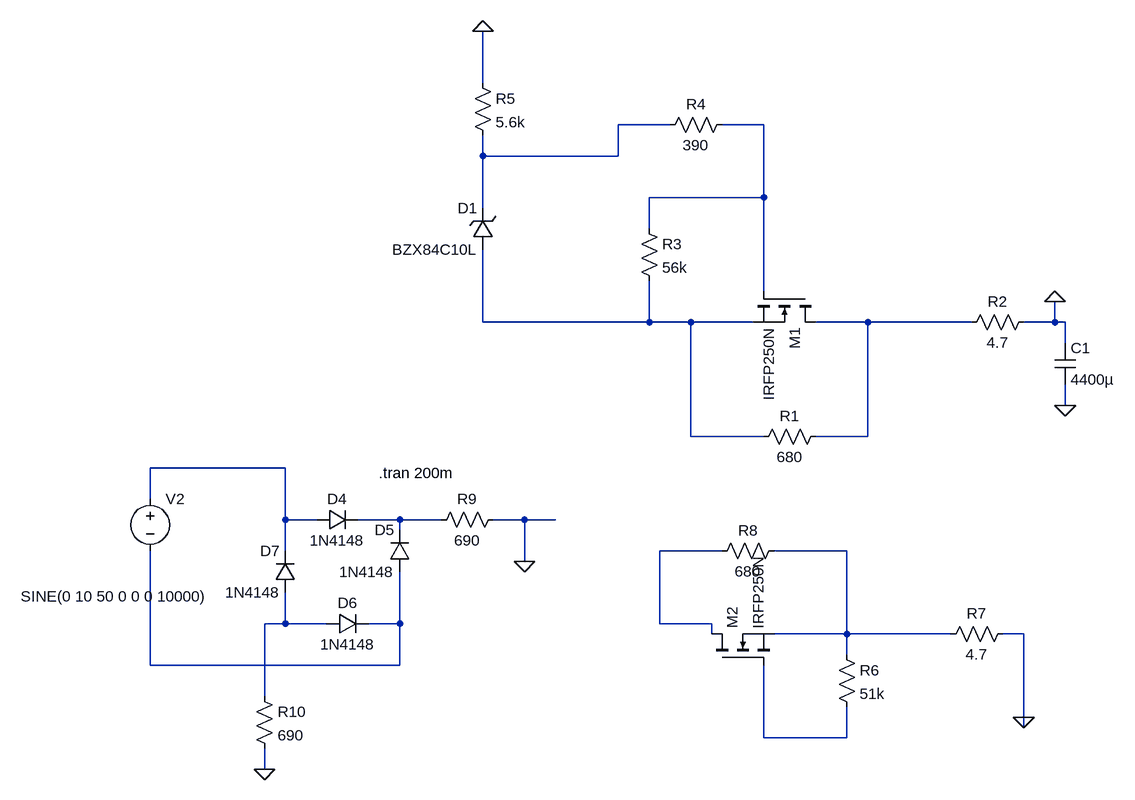
[diagram p0: schematic ikmi.asc]
ikmi.asc, the LTspice schematic file:
Version 4.1
SHEET 1 880 900
WIRE -256 -176 -256 -256
WIRE 32 -112 -48 -112
WIRE 176 -112 112 -112
WIRE -256 -64 -256 -96
WIRE -48 -64 -48 -112
WIRE -48 -64 -256 -64
WIRE 176 0 176 -112
WIRE 176 0 0 0
WIRE -256 16 -256 -64
WIRE 0 48 0 0
WIRE 176 144 176 0
WIRE -256 192 -256 80
WIRE 0 192 0 128
WIRE 0 192 -256 192
WIRE 64 192 0 192
WIRE 160 192 64 192
WIRE 336 192 256 192
WIRE 496 192 336 192
WIRE 624 192 624 160
WIRE 624 192 576 192
WIRE 640 192 624 192
WIRE 640 224 640 192
WIRE 640 320 640 288
WIRE 64 368 64 192
WIRE 176 368 64 368
WIRE 336 368 336 192
WIRE 336 368 256 368
WIRE -560 416 -768 416
WIRE -768 464 -768 416
WIRE -560 496 -560 416
WIRE -512 496 -560 496
WIRE -384 496 -448 496
WIRE -320 496 -384 496
WIRE -192 496 -240 496
WIRE -144 496 -192 496
WIRE -384 512 -384 496
WIRE -560 544 -560 496
WIRE 112 544 16 544
WIRE 304 544 192 544
WIRE -192 560 -192 496
WIRE -560 656 -560 608
WIRE -560 656 -592 656
WIRE -496 656 -560 656
WIRE -384 656 -384 576
WIRE -384 656 -432 656
WIRE 16 656 16 544
WIRE 96 656 16 656
WIRE 96 672 96 656
WIRE 304 672 304 544
WIRE 304 672 192 672
WIRE 464 672 304 672
WIRE 576 672 544 672
WIRE 304 704 304 672
WIRE -768 720 -768 544
WIRE -384 720 -384 656
WIRE -384 720 -768 720
WIRE -592 768 -592 656
WIRE 576 800 576 672
WIRE 576 816 576 800
WIRE 176 832 176 720
WIRE 304 832 304 784
WIRE 304 832 176 832
WIRE -592 880 -592 848
FLAG -256 -256 0
FLAG 640 320 0
FLAG 576 800 0
FLAG 624 160 0
FLAG -192 560 0
FLAG -592 880 0
DATAFLAG 112 368 ""
DATAFLAG 176 48 ""
DATAFLAG -192 192 ""
DATAFLAG -256 -16 ""
SYMBOL nmos 256 144 R90
SYMATTR InstName M1
SYMATTR Value IRFP250N
SYMBOL res 272 352 R90
WINDOW 0 0 56 VBottom 2
WINDOW 3 32 56 VTop 2
SYMATTR InstName R1
SYMATTR Value 680
SYMBOL res 592 176 R90
WINDOW 0 0 56 VBottom 2
WINDOW 3 32 56 VTop 2
SYMATTR InstName R2
SYMATTR Value 4.7
SYMBOL res -16 32 R0
SYMATTR InstName R3
SYMATTR Value 56k
SYMBOL res 128 -128 R90
WINDOW 0 0 56 VBottom 2
WINDOW 3 32 56 VTop 2
SYMATTR InstName R4
SYMATTR Value 390
SYMBOL zener -240 80 R180
WINDOW 0 24 64 Left 2
WINDOW 3 24 0 Left 2
SYMATTR InstName D1
SYMATTR Value BZX84C10L
SYMATTR Description Diode
SYMATTR Type diode
SYMBOL res -272 -192 R0
SYMATTR InstName R5
SYMATTR Value 5.6k
SYMBOL voltage -768 448 R0
WINDOW 3 -199 166 Left 2
WINDOW 123 0 0 Left 0
WINDOW 39 0 0 Left 0
SYMATTR InstName V2
SYMATTR Value SINE(0 10 50 0 0 0 10000)
SYMBOL diode -512 512 R270
WINDOW 0 32 32 VTop 2
WINDOW 3 0 32 VBottom 2
SYMATTR InstName D4
SYMATTR Value 1N4148
SYMBOL diode -496 672 R270
WINDOW 0 32 32 VTop 2
WINDOW 3 0 32 VBottom 2
SYMATTR InstName D6
SYMATTR Value 1N4148
SYMBOL diode -544 608 R180
WINDOW 0 24 64 Left 2
WINDOW 3 24 0 Left 2
SYMATTR InstName D7
SYMATTR Value 1N4148
SYMBOL diode -368 576 R180
WINDOW 0 24 64 Left 2
WINDOW 3 24 0 Left 2
SYMATTR InstName D5
SYMATTR Value 1N4148
SYMBOL cap 624 224 R0
SYMATTR InstName C1
SYMATTR Value 4400µ
SYMBOL nmos 96 720 R270
SYMATTR InstName M2
SYMATTR Value IRFP250N
SYMBOL res 288 688 R0
SYMATTR InstName R6
SYMATTR Value 51k
SYMBOL res 560 656 R90
WINDOW 0 0 56 VBottom 2
WINDOW 3 32 56 VTop 2
SYMATTR InstName R7
SYMATTR Value 4.7
SYMBOL res 208 528 R90
WINDOW 0 0 56 VBottom 2
WINDOW 3 32 56 VTop 2
SYMATTR InstName R8
SYMATTR Value 680
SYMBOL res -224 480 R90
WINDOW 0 0 56 VBottom 2
WINDOW 3 32 56 VTop 2
SYMATTR InstName R9
SYMATTR Value 690
SYMBOL res -608 752 R0
SYMATTR InstName R10
SYMATTR Value 690
TEXT -416 424 Left 2 !.tran 200m

The netlist it stands for:
* ikmi.asc
M1 N004 N002 N003 N003 IRFP250N
R1 N004 N003 680
R2 0 N004 4.7
R3 N002 N003 56k
R4 N002 N001 390
D1 N003 N001 BZX84C10L
R5 0 N001 5.6k
V2 N005 N010 SINE(0 10 50 0 0 0 10000)
D4 N005 N006 1N4148
D6 N009 N010 1N4148
D7 N009 N005 1N4148
D5 N010 N006 1N4148
C1 0 0 4400µ
M2 N007 N011 N008 N008 IRFP250N
R6 N008 N011 51k
R7 0 N008 4.7
R8 N008 N007 680
R9 0 N006 690
R10 N009 0 690
.model D D
.lib standard.dio
.model NMOS NMOS
.model PMOS PMOS
.lib standard.mos
.tran 200m
.backanno
.end